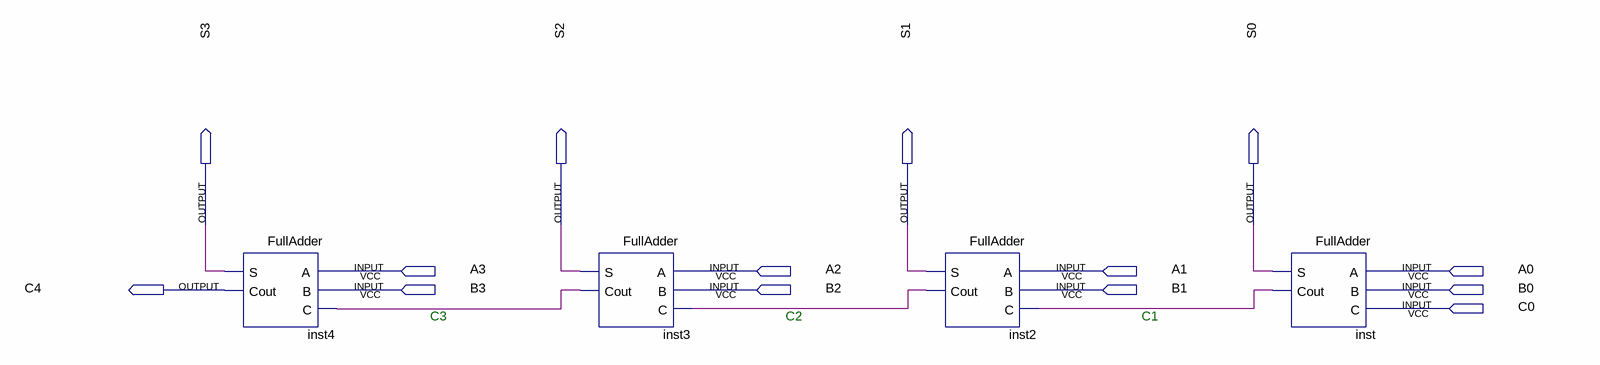
[diagram p0: schematic sheet]
// Quartus schematic RippleCarryAdder.bdf as structural Verilog: 4 symbols, 14 pins
module RippleCarryAdder (
  input  A3,
  input  A2,
  input  A1,
  input  A0,
  input  B3,
  input  B2,
  input  B1,
  input  B0,
  input  C0,
  output S3,
  output S2,
  output S1,
  output S0,
  output C4
);

  wire inst2_cout, inst3_cout, inst_cout;

  FullAdder inst4 (.A(A3), .B(B3), .C(inst3_cout), .S(S3), .Cout(C4));
  FullAdder inst3 (.A(A2), .B(B2), .C(inst2_cout), .S(S2), .Cout(inst3_cout));
  FullAdder inst2 (.A(A1), .B(B1), .C(inst_cout), .S(S1), .Cout(inst2_cout));
  FullAdder inst (.A(A0), .B(B0), .C(C0), .S(S0), .Cout(inst_cout));

  // Notes on the sheet:
  //   C3
  //   C2
  //   C1
endmodule
